# EAGLE design AdjustableLoad (EAGLE 7.6.0)
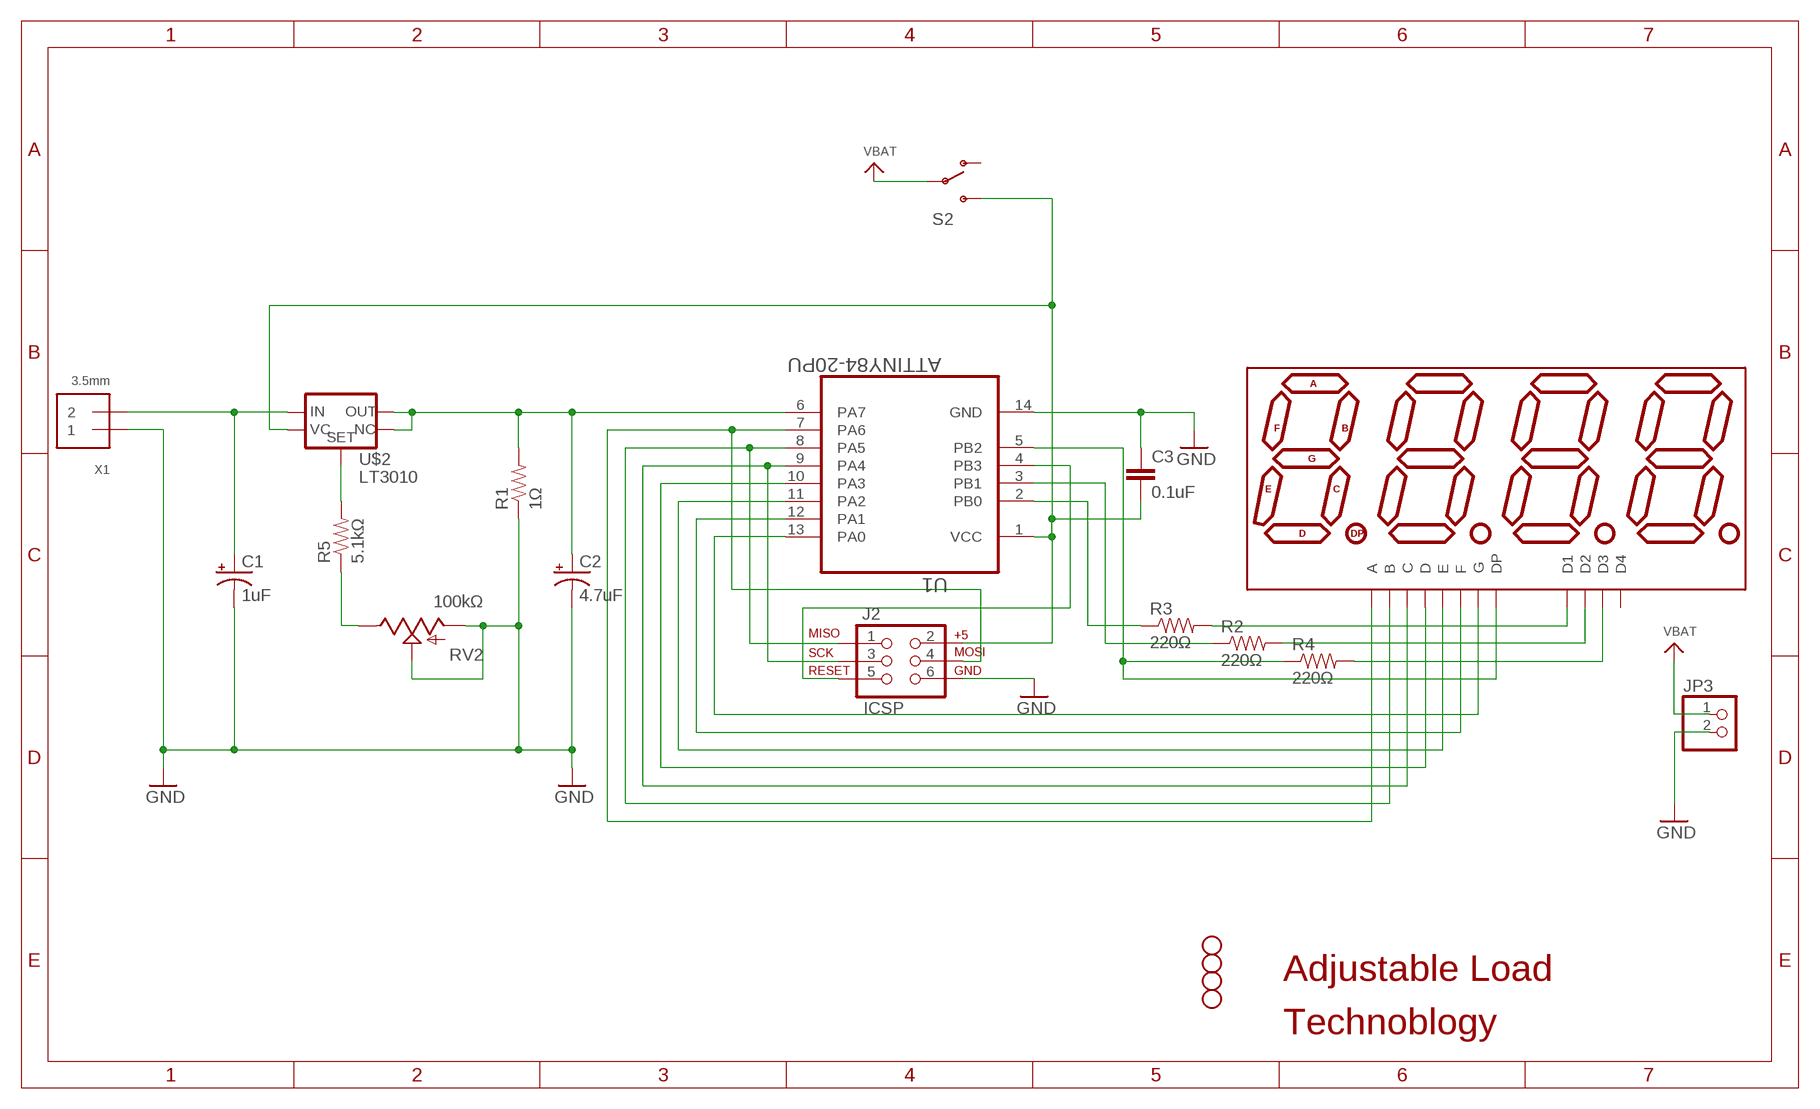
[diagram p0: schematic, sheet 1]

## Parts
C1  1uF  CAP_POLPTH2  [CPOL-RADIAL-10UF-25V]
C2  4.7uF  CAP_POLPTH2  [CPOL-RADIAL-10UF-25V]
C3  0.1uF  0.1UF-50V-20%(PTH)KIT-EZ  [CAP-PTH-SMALL-KIT]
DISP1  KYX-2381  7-SEGMENT-4DIGIT-COUNTER-KYX-2381  [KYX-2381]
J2  ICSP  AVR_SPI_PRG_6PTH  [2X3]
JP1  STAND-OFF  [STAND-OFF]
JP2  STAND-OFF  [STAND-OFF]
JP3  HEADER-1X2ROUND  [1X02_ROUND]
JP4  STAND-OFF  [STAND-OFF]
JP5  STAND-OFF  [STAND-OFF]
R1  1Ω  RESISTORPTH-1W  [AXIAL-0.6]
R2  220Ω  RESISTORPTH-1/4W  [AXIAL-0.4]
R3  220Ω  RESISTORPTH-1/4W  [AXIAL-0.4]
R4  220Ω  RESISTORPTH-1/4W  [AXIAL-0.4]
R5  5.1kΩ  RESISTORPTH-1/4W  [AXIAL-0.4]
RV2  100kΩ  POT  [ALPS_POT]
S2  SWITCH-SPDTPTH  [SWITCH-SPDT]
U1  ATTINY84-20PU  [DIP254P762X533-14]
U$2  LT3010  V_REG_LD1117VXX  [78XXL]
X1  3.5mm  TERMBLOCK_1X2  [TERMBLOCK_1X2-3.5MM]

## Nets
GND: C1.2(-) C2.2(-) C3.1 J2.6 JP3.2 R1.P$1 RV2.P$2(S) RV2.P$3(A) U1.14(GND) X1.1
N$2: DISP1.5(G) U1.13(PA0)
N$3: R5.P$1 RV2.P$1(E)
N$4: J2.5 U1.4(PB3)
N$5: C2.1(+) R1.P$2 U1.6(PA7) U$2.NC U$2.OUT
N$6: R5.P$2 U$2.SET
N$7: DISP1.10(F) U1.12(PA1)
N$8: DISP1.1(E) U1.11(PA2)
N$9: DISP1.2(D) U1.10(PA3)
N$10: DISP1.4(C) J2.3 U1.9(PA4)
N$11: DISP1.7(B) J2.1 U1.8(PA5)
N$13: DISP1.12(D1) R3.P$2
N$15: DISP1.9(D2) R2.P$2
N$16: DISP1.8(D3) R4.P$2
N$17: R3.P$1 U1.2(PB0)
N$18: R2.P$1 U1.3(PB1)
N$19: DISP1.3(DP) R4.P$1 U1.5(PB2)
N$20: C1.1(+) U$2.IN X1.2
N$22: DISP1.11(A) J2.4 U1.7(PA6)
VBAT: JP3.1 S2.2(P)
VCC: C3.2 J2.2 S2.3(S) U1.1(VCC) U$2.VCONTROL
Unconnected: DISP1.6(D4) S2.1(O)

## Notes on the sheet
- Adjustable Load
- Technoblogy

## Library data of the parts
C1 C2 = SparkFun-Capacitors:CAP_POL: Capacitor Polarized These are standard SMD and PTH capacitors. Normally 10uF, 47uF, and 100uF in electrolytic and tantalum varieties. Always verify the external diameter of the through hole cap, it varies with capacity, voltage, and manufacturer. The EIA devices should be standard.
C3 = SparkFun-Capacitors:0.1UF-50V-20%(PTH): CAP-08370; PROD_ID: CAP-08370
DISP1 = djd-displays:7-SEGMENT-4DIGIT-COUNTER
J2 = SparkFun:AVR_SPI_PRG_6: AVR ISP 6 Pin This is the reduced ISP connector for AVR programming. Common on Arduino. This footprint will take up less PCB space and can be used with a 10-pin to 6-pin adapter such as SKU: BOB-08508
JP1 JP2 JP4 JP5 = SparkFun:STAND-OFF: Stand Off This is the mechanical footprint for a #4 phillips button head screw. Use the keepout ring to avoid running the screw head into surrounding components. SKU : PRT-00447
JP3 = microbuilder:HEADER-1X2: PIN HEADER
R1 = SparkFun-Resistors:RESISTOR: Resistor Basic schematic elements and footprints for 0603, 1206, and PTH resistors.
R2-R5 = SparkFun-Passives:RESISTOR: Resistor Basic schematic elements and footprints for 0603, 1206, and PTH resistors.
RV2 = SparkFun-Electromechanical:POT; PROD_ID: RES-09177
S2 = SparkFun-Electromechanical:SWITCH-SPDT: SPDT Switch Simple slide switch, Spark Fun Electronics SKU : COM-00102 DPDT SMT slide switch, AYZ0202, SWCH-08179; PROD_ID: SWCH-08261
U1 = Atmel_By_element14_Batch_1-00:ATTINY84-20PU: 8-bit Microcontroller with In-System Programmable Flash; MPN: ATTINY84-20PU; OC_FARNELL: -; OC_NEWARK: 58M3794; PACKAGE: PDIP-14; SUPPLIER: Atmel
U$2 = technoblogy:V_REG_LD1117VXX: LD1117VXX voltage regulator. We carry the 3.3V version (COM-00526) in TO-220 package.
X1 = microbuilder:TERMBLOCK_1X2: 3.5mm Terminal block http://www.ladyada.net/library/pcb/eaglelibrary.html

## Net classes
0 default: width 0.152 mm, drill 0.305 mm, clearance 0.152 mm

## Board
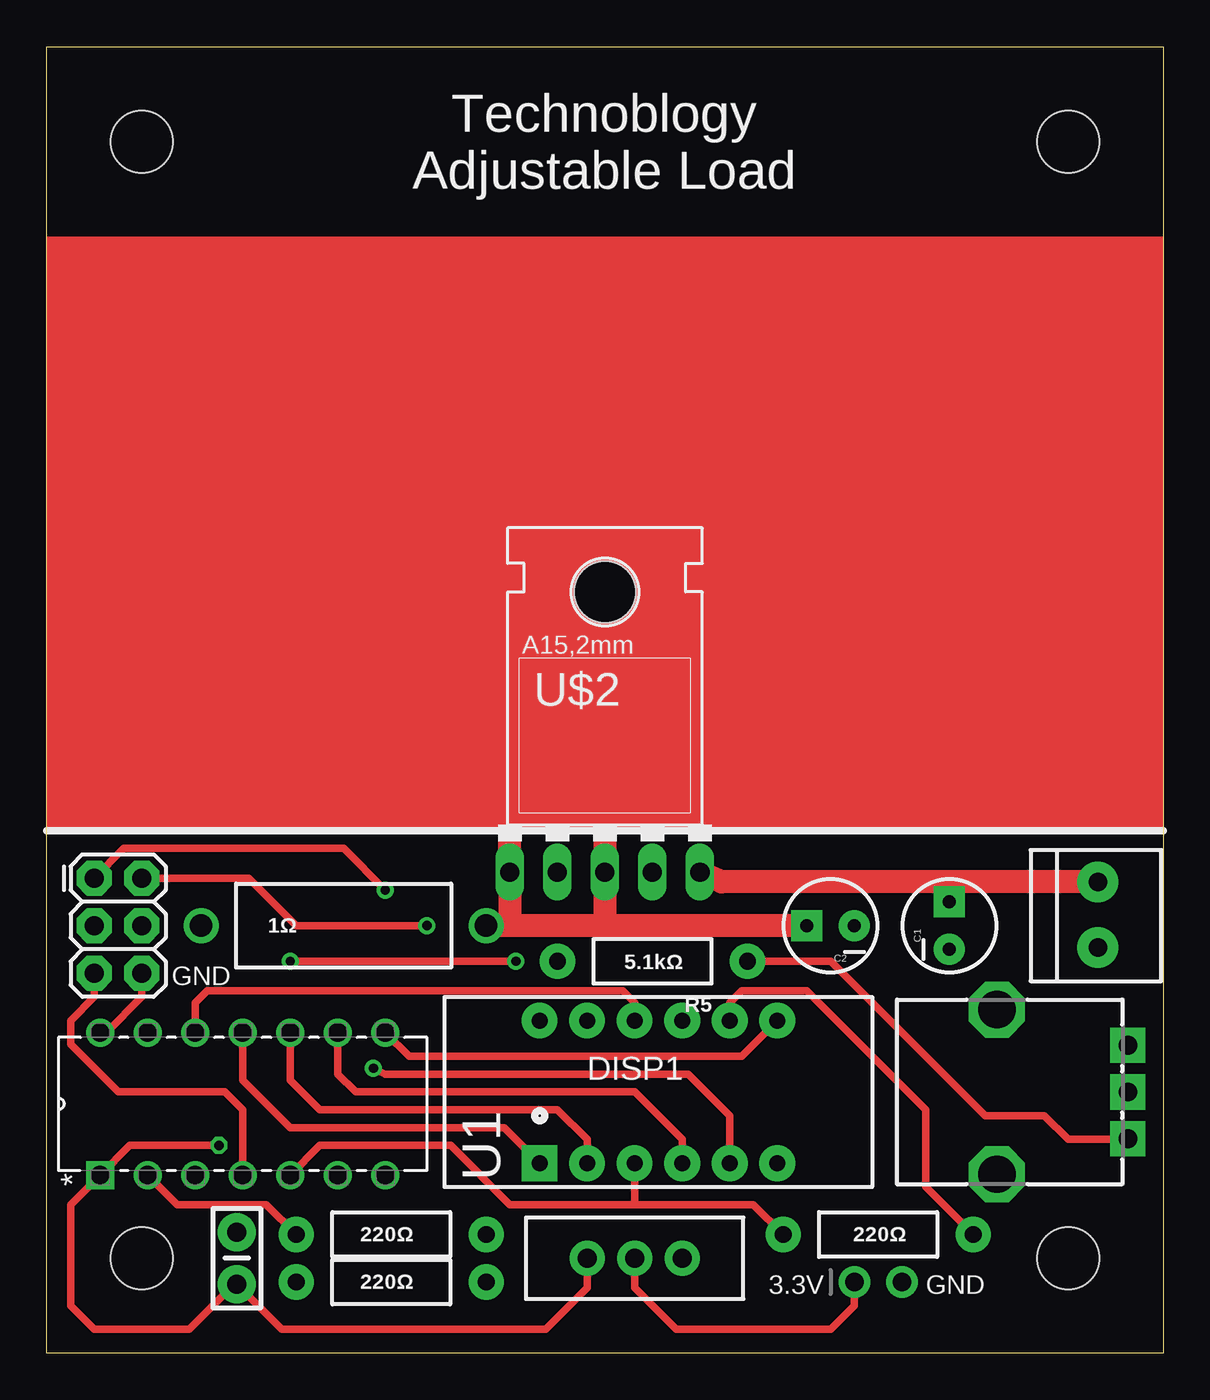
[diagram p1: board, top side]
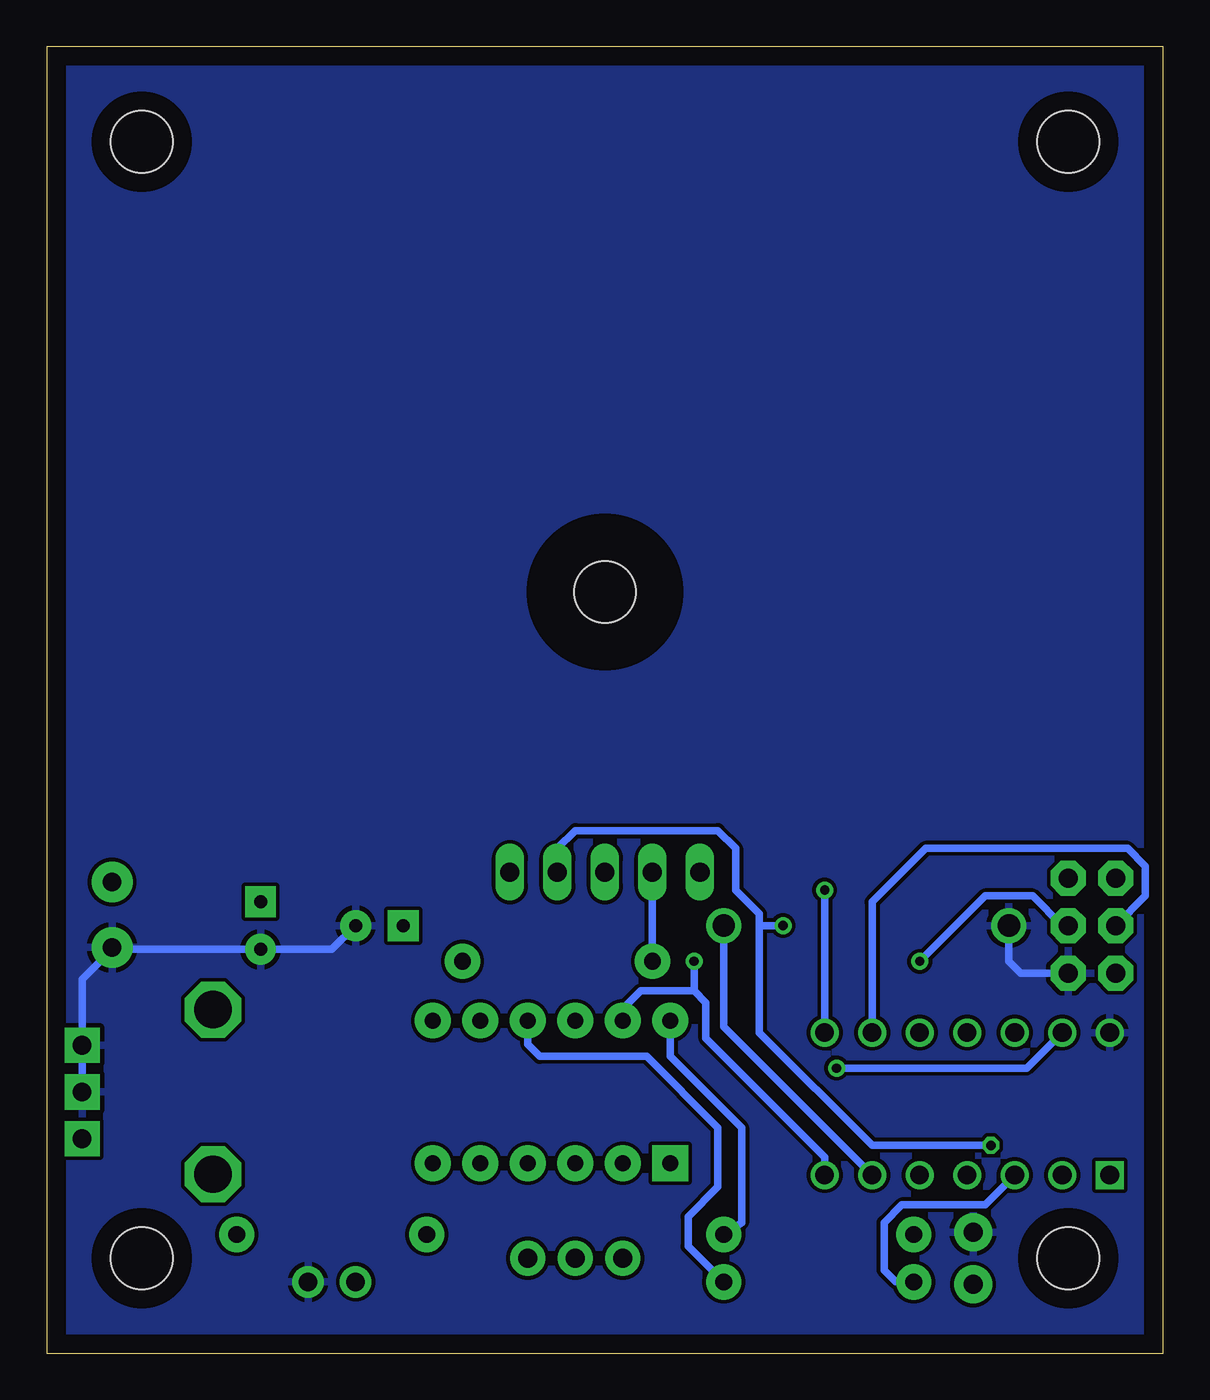
[diagram p2: board, bottom side, seen from below]

Size 59.69 x 69.85 mm. Coordinates in mm from the lower left corner, seen from the top.
Outline: 0,69.85 59.69,69.85 59.69,0 0,0 0,69.85
Copper layers (1*16): Top 0.035mm / dielectric 1.5mm / Bottom 0.035mm
Design rules "default *": minimum track width 10mil, minimum drill 24mil, track to track 8mil, track to pad 8mil, pad to pad 8mil, via to via 8mil, smd to smd 8mil, copper to edge 40mil, drill to drill 8mil, minimum pad ring 10mil, minimum via ring 8mil, stop-mask expansion 4mil, vias tented up to drill 20mil, thermal gap 10mil

### Footprints (pad centres in the part's own frame; a part is rotated, then mirrored left to right if it is on the bottom)
CPOL-RADIAL-10UF-25V = drill 0.7 pad 1.651 square: 1 1.27,0 | drill 0.7 pad 1.651: 2 -1.27,0
CAP-PTH-SMALL-KIT = drill 1.016 pad 2.032: 1 -1.397,0; 2 1.397,0
KYX-2381 = drill 0.864 pad 1.905 square: 1 -6.35,-3.81 | drill 0.864 pad 1.905: 2 -3.81,-3.81; 3 -1.27,-3.81; 4 1.27,-3.81; 5 3.81,-3.81; 6 6.35,-3.81; 7 6.35,3.81; 8 3.81,3.81; 9 1.27,3.81; 10 -1.27,3.81; 11 -3.81,3.81; 12 -6.35,3.81
2X3 = drill 1.016 pad 1.88 octagon: 1 0,0; 2 0,2.54; 3 2.54,0; 4 2.54,2.54; 5 5.08,0; 6 5.08,2.54
STAND-OFF = hole 3.302: 0,0
1X02_ROUND = drill 1 pad 1.676: 1 -1.27,0; 2 1.27,0
AXIAL-0.6 = drill 1.2 pad 1.88: P$1 -7.62,0; P$2 7.62,0
AXIAL-0.4 = drill 0.9 pad 1.88: P$1 -5.08,0; P$2 5.08,0
ALPS_POT = drill 1 pad 1.88 square: P$1 7,-2.5; P$2 7,0; P$3 7,2.5 | drill 2 octagon: P$4 0,-4.4; P$5 0,4.4
SWITCH-SPDT = drill 1.016 pad 1.88: 1 0,2.54; 2 0,0; 3 0,-2.54
DIP254P762X533-14 = drill 0.991 square: 1 -7.62,15.24 | drill 0.991: 2 -7.62,12.7; 3 -7.62,10.16; 4 -7.62,7.62; 5 -7.62,5.08; 6 -7.62,2.54; 7 -7.62,0; 8 0,0; 9 0,2.54; 10 0,5.08; 11 0,7.62; 12 0,10.16; 13 0,12.7; 14 0,15.24
78XXL = drill 1.016 long: IN 5.08,-3.81; NC -5.08,-3.81; OUT 0,-3.81; SET -2.54,-3.81; VCONTROL 2.54,-3.81 | hole 3.302: 0,11.176
TERMBLOCK_1X2-3.5MM = drill 1 pad 2.184: 1 1.8,0; 2 -1.7,0

### Placement (x,y rotation side)
C1  48.26,22.86 90 top
C2  41.91,22.86 180 top
C3  10.16,5.08 270 top
DISP1  32.7,13.97 0 top
J2  2.54,25.4 270 top
JP1  5.08,64.77 0 top
JP2  54.61,64.77 0 top
JP3  44.45,3.81 0 top
JP4  5.08,5.08 0 top
JP5  54.61,5.08 0 top
R1  15.88,22.86 0 top
R2  18.41,3.81 0 top
R3  18.41,6.35 0 top
R4  44.45,6.35 0 top
R5  32.38,20.95 180 top
RV2  50.8,13.97 0 top
S2  31.43,5.08 270 top
U1  18.1,17.14 90 top
U$2  29.84,29.53 0 top
X1  56.2,23.5 270 top

### Tracks (layer width: path | path; a pad name or v marks a point on that pad's centre or on a via)
GND
  Top 0.406: J2.6 5.08,19.05 3.17,17.14 U1.14
  Bottom 0.406: C2.2 44.45,21.59 C1.2 56.09,21.59 | 56.09,21.59 X1.1 | R1.P$1 8.26,20.95 7.62,20.32 J2.6 | 56.09,21.59 56.2,21.59 57.78,20 57.78,16.48 RV2.P$3 RV2.P$2
  pour Bottom: 0,0 59.69,0 59.69,69.85 0,69.85
N$2  (via drill 0.5)
  Top 0.406: DISP1.5 36.51,12.7 34.29,14.92 18.1,14.92 v17.46,15.24
  Bottom 0.406: U1.13 7.3,15.24 v17.46,15.24
N$3  (via drill 0.6)
  Top 0.406: v57.76,11.43 54.61,11.43 53.34,12.7 50.16,12.7 41.91,20.95 R5.P$1
  Bottom 0.406: v57.76,11.43 RV2.P$1
N$4
  Top 0.406: U1.4 10.48,13.02 9.53,13.97 3.81,13.97 1.27,16.51 1.27,17.78 2.54,19.05 J2.5
N$5
  Top 1.219: 29.84,22.86 U$2.OUT 29.84,28.57 24.77,28.57 U$2.NC 24.77,22.86 | 29.84,22.86 24.77,22.86 | 24.77,22.86 R1.P$2 | C2.1 29.84,22.86
  Bottom 0.406: R1.P$2 23.5,17.46 U1.6
N$6
  Bottom 0.406: R5.P$2 U$2.SET
N$7
  Top 0.406: DISP1.10 31.43,18.73 30.8,19.37 8.57,19.37 7.94,18.73 U1.12
N$8
  Top 0.406: U1.11 10.48,14.61 13.02,12.06 24.45,12.06 DISP1.1
N$9
  Top 0.406: U1.10 13.02,14.61 14.61,13.02 27.3,13.02 28.89,11.43 DISP1.2
N$10
  Top 0.406: U1.9 15.56,14.92 16.51,13.97 31.43,13.97 33.97,11.43 DISP1.4
  Bottom 0.406: J2.3 0.95,24.45 0.95,26.04 1.91,26.99 12.7,26.99 15.56,24.13 U1.9
N$11  (via drill 0.5)
  Top 0.406: U1.8 19.37,15.88 37.15,15.88 DISP1.7 | J2.1 4.13,26.99 15.88,26.99 v18.1,24.77
  Bottom 0.406: v18.1,24.77 U1.8
N$13
  Bottom 0.406: DISP1.12 26.35,15.88 22.54,12.06 22.54,6.99 R3.P$2
N$15
  Bottom 0.406: R2.P$2 25.4,5.71 25.4,7.3 23.81,8.89 23.81,12.06 27.62,15.88 33.34,15.88 33.97,16.51 DISP1.9
N$16
  Top 0.406: DISP1.8 36.51,18.73 37.15,19.37 40.64,19.37 46.99,13.02 46.99,8.89 R4.P$2
N$17
  Top 0.406: U1.2 6.99,7.94 11.75,7.94 R3.P$1
N$18
  Bottom 0.406: R2.P$1 14.29,3.81 14.92,4.45 14.92,6.99 13.97,7.94 9.53,7.94 U1.3
N$19
  Top 0.406: U1.5 14.61,11.11 21.59,11.11 24.77,7.94 31.43,7.94 | 31.43,7.94 37.78,7.94 R4.P$1 | 31.43,7.94 DISP1.3
N$20
  Top 0.61: C1.1 48.26,25.2
  Top 1.219: X1.2 48.26,25.2 36.08,25.2 U$2.IN
N$22  (via drill 0.5)
  Top 0.406: v13.02,20.95 v25.08,20.95
  Bottom 0.406: DISP1.11 28.89,18.41 27.94,19.37 25.08,19.37 | U1.7 18.1,10.48 24.45,16.83 24.45,18.73 25.08,19.37 | v13.02,20.95 9.53,24.45 6.99,24.45 5.4,22.86 J2.4 | v25.08,20.95 25.08,19.37
VBAT
  Top 0.406: S2.2 31.43,3.49 33.66,1.27 41.91,1.27 43.18,2.54 JP3.1
VCC  (via drill 0.5)
  Top 0.406: S2.3 28.89,3.49 26.67,1.27 12.57,1.27 C3.2 10.03,3.68 7.62,1.27 2.54,1.27 1.27,2.54 1.27,7.94 U1.1 4.45,11.11 v9.21,11.11 | J2.2 10.79,25.4 13.34,22.86 v20.32,22.86
  Bottom 0.406: U$2.VCONTROL 32.38,26.99 31.43,27.94 23.81,27.94 22.86,26.99 22.86,24.77 21.59,23.5 21.59,22.86 | 21.59,22.86 21.59,17.14 15.56,11.11 v9.21,11.11 | v20.32,22.86 21.59,22.86
(copper drawn outside any net)
  shapes: Top area x1

### Text on the board
tPlace: Technoblogy / Adjustable Load | GND | 3.3V | GND